# Altium project APP_1_huom2704.PrjPcb (part 3 of 3)

## Sheet APP_1_JTAG_m.SchDoc
size Tabloid; SheetNumber: 14; SheetTotal: 14; Sheet_Name: JTAG; Size: 11x17
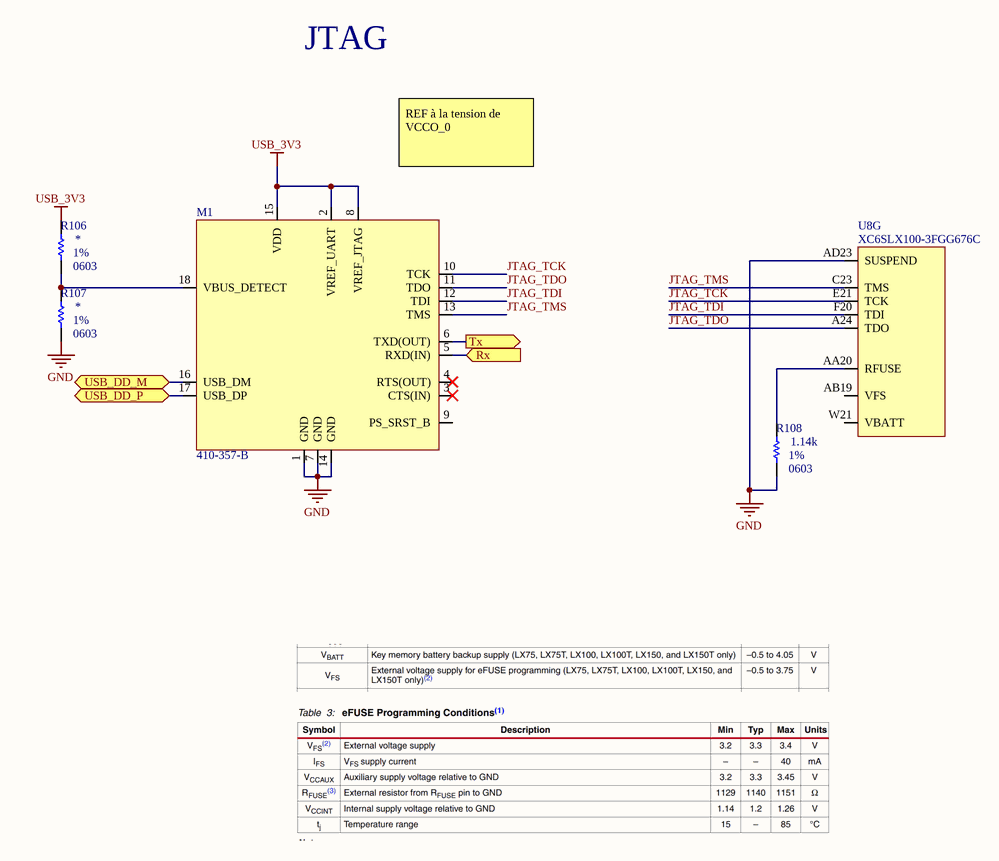
[diagram p12: APP_1_JTAG_m.SchDoc]

### Parts
M1  410-357-B  [MOD_JTAG_410-357-B]
R106  Package: 0603  Precision: 1%  [RES_0603]  (hidden comment: RES - 0603)
R107  Package: 0603  Precision: 1%  [RES_0603]  (hidden comment: RES - 0603)
R108  value 1.14k  Package: 0603  Precision: 1%  [RES_0603]  (hidden comment: RES - 0603)
U8  XC6SLX100-3FGG676C  [FPGA_XILINX_FGG676]  (part G of 10)

### Ports
Rx (in), Tx (out), USB_DD_M (bidir, see APP_1_Connectors_m[3B]), USB_DD_P (bidir, see APP_1_Connectors_m[3B])

### Nets
GND: M1.1(GND) M1.7(GND) M1.14(GND) R107.1 R108.1 U8.AD23(SUSPEND)
USB_3V3: M1.2(VREF_UART) M1.8(VREF_JTAG) M1.15(VDD) R106.2
JTAG_TCK: M1.10(TCK) U8.E21(TCK)
JTAG_TDI: M1.12(TDI) U8.F20(TDI)
JTAG_TDO: M1.11(TDO) U8.A24(TDO)
JTAG_TMS: M1.13(TMS) U8.C23(TMS)
Rx: M1.5(RXD(IN)) ; port Rx
Tx: M1.6(TXD(OUT)) ; port Tx
USB_DD_M: M1.16(USB_DM) ; port USB_DD_M
USB_DD_P: M1.17(USB_DP) ; port USB_DD_P
NetM1_18: M1.18(VBUS_DETECT) R106.1 R107.2
NetR108_2: R108.2 U8.AA20(RFUSE)

Not connected (* = marked no-connect by the designer): M1 3(CTS(IN))* 4(RTS(OUT))* 9(PS_SRST_B); U8 AB19(VFS) W21(VBATT)

### Notes on the sheet
- JTAG
- REF à la tension de VCCO_0
- Sheet Name
- Project Title
- Global Project
- Size
- Group
- Revision
- Date
- Sheet
- of
- Filename
- Designers

### Library data of the parts
M1 = MOD_JTAG_410-357-B: MOD - JTAG-SMT3-NC Programming Module For Xilinx FPGA - 18-SMT; Manufacturer #1: Digilent; Voltage Rating: VDD: 2.97V~3.63V, VJTAG/VUART: 1.65V~5.5V; GRAMS Lib Spec: 2.8; Note: Prior to reflow, the JTAG-SMT3-NC module must be dried at 125°C for 17 hours; Magnetic Material: Unknown; Polarized: Yes; Value: *; Tolerance: *; Current Rating: *; Power Max: *; HelpURL: https://reference.digilentinc.com/_media/reference/programmers/jtag-smt3/jtag-smt3-nc_rm.pdf; CreatedBy/Date: Tommy Rossignol 2018-11-23; VerifiedBy: Nicolas V. (2019-01-28); Temperature: -40°C ~ 85°C; Package: 18-pad SMT; Manufacturer #2: *; Assembly Type: SMD; Part Number #2: *; Part Number #1: 410-357-B; Supplier 1: Digi-Key; Supplier Part Number 1: 1286-1196-ND; Cryo: UNKNOWN
U8 = FPGA_XC6SLX100-3FGG676C: FPGA - XILINX SPARTAN 6 480 I/O - BGA-676; Voltage: 1.14 V ~ 1.26 V; Current: *; Power: *; Mfg: Xilinx; Mfg Part Number: XC6SLX100-3FGG676C; HelpURL: https://www.xilinx.com/support/documentation/data_sheets/ds162.pdf; CreatedBy: Jonathan Bouchard; Temperature: 0°C ~ 85°C (TJ); Value: *; Precision: *; Package: BGA-676; Supplier 1: Digikey; Supplier Part Number 1: 122-1760-ND
R106-R108 = RES - 0603: Current: *; CreatedBy: Jonathan Bouchard
  R106 R107: Value: *

## Sheet APP_1_PowerAnalog.SchDoc
size Tabloid; SheetNumber: 15; SheetTotal: 16; Sheet_Name: Power; Size: 11x17
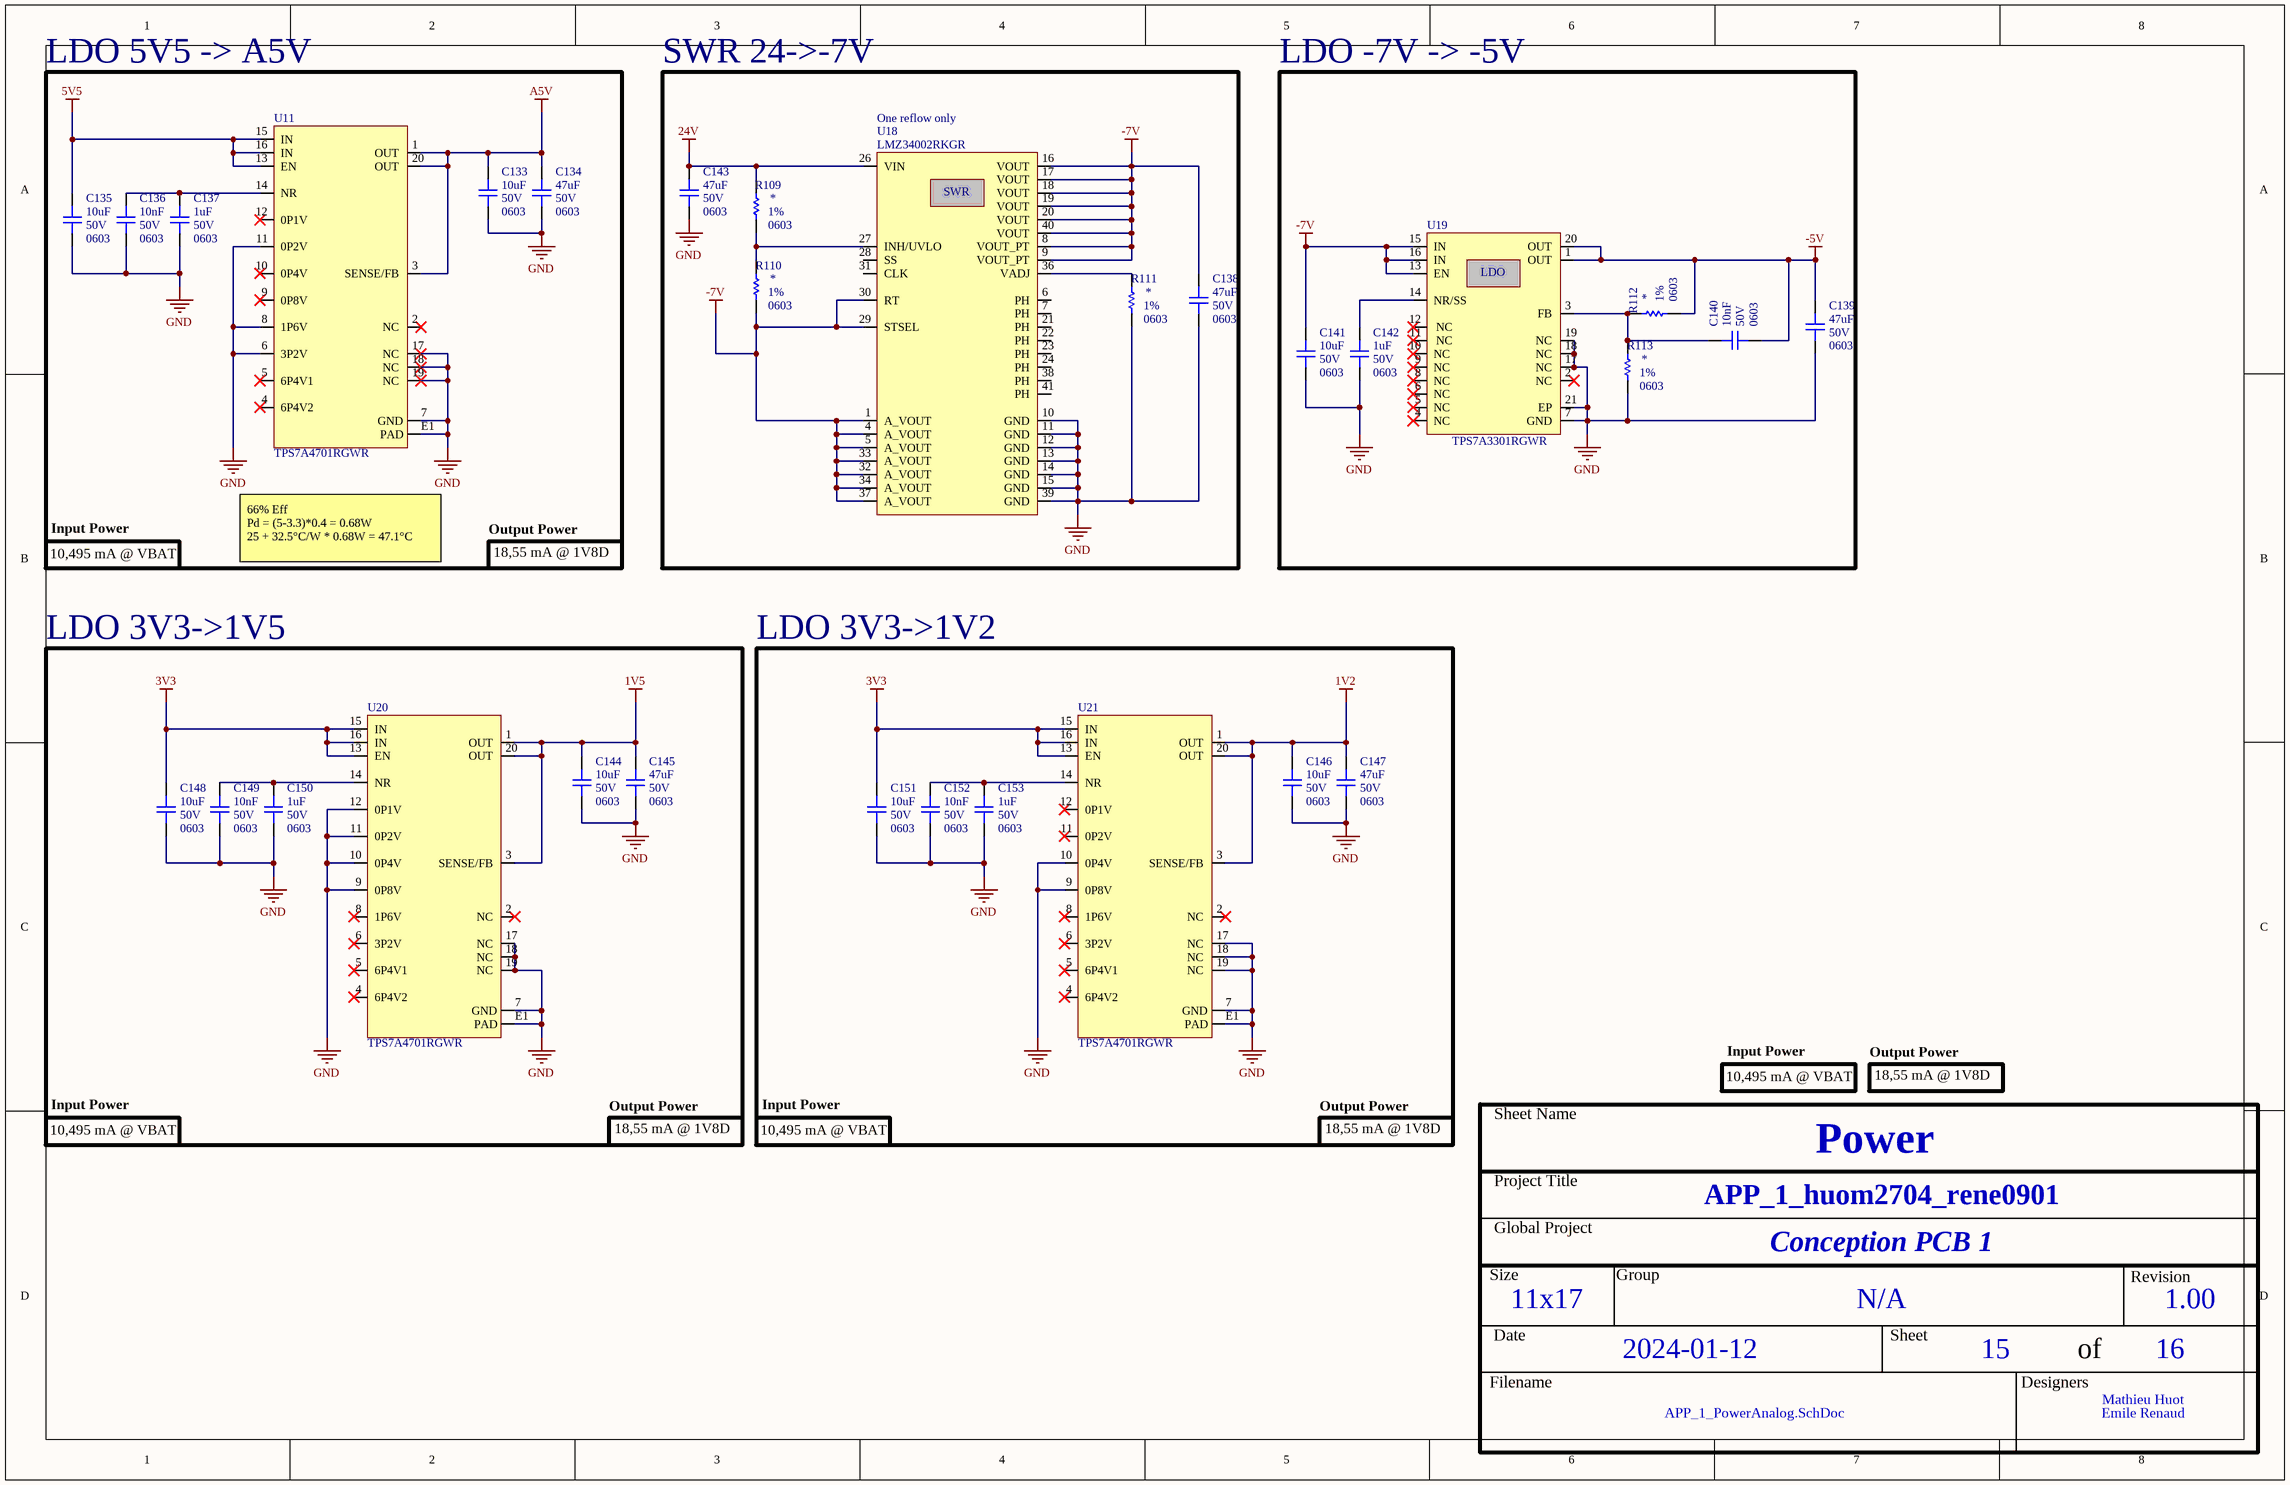
[diagram p13: APP_1_PowerAnalog.SchDoc]

### Parts
C133  value 10uF  Voltage: 50V  Package: 0603  [CAP_0603]  (hidden comment: CAP - 0603)
C134  value 47uF  Voltage: 50V  Package: 0603  [CAP_0603]  (hidden comment: CAP - 0603)
C135  value 10uF  Voltage: 50V  Package: 0603  [CAP_0603]  (hidden comment: CAP - 0603)
C136  value 10nF  Voltage: 50V  Package: 0603  [CAP_0603]  (hidden comment: CAP - 0603)
C137  value 1uF  Voltage: 50V  Package: 0603  [CAP_0603]  (hidden comment: CAP - 0603)
C138  value 47uF  Voltage: 50V  Package: 0603  [CAP_0603]  (hidden comment: CAP - 0603)
C139  value 47uF  Voltage: 50V  Package: 0603  [CAP_0603]  (hidden comment: CAP - 0603)
C140  value 10nF  Voltage: 50V  Package: 0603  [CAP_0603]  (hidden comment: CAP - 0603)
C141  value 10uF  Voltage: 50V  Package: 0603  [CAP_0603]  (hidden comment: CAP - 0603)
C142  value 1uF  Voltage: 50V  Package: 0603  [CAP_0603]  (hidden comment: CAP - 0603)
C143  value 47uF  Voltage: 50V  Package: 0603  [CAP_0603]  (hidden comment: CAP - 0603)
C144  value 10uF  Voltage: 50V  Package: 0603  [CAP_0603]  (hidden comment: CAP - 0603)
C145  value 47uF  Voltage: 50V  Package: 0603  [CAP_0603]  (hidden comment: CAP - 0603)
C146  value 10uF  Voltage: 50V  Package: 0603  [CAP_0603]  (hidden comment: CAP - 0603)
C147  value 47uF  Voltage: 50V  Package: 0603  [CAP_0603]  (hidden comment: CAP - 0603)
C148  value 10uF  Voltage: 50V  Package: 0603  [CAP_0603]  (hidden comment: CAP - 0603)
C149  value 10nF  Voltage: 50V  Package: 0603  [CAP_0603]  (hidden comment: CAP - 0603)
C150  value 1uF  Voltage: 50V  Package: 0603  [CAP_0603]  (hidden comment: CAP - 0603)
C151  value 10uF  Voltage: 50V  Package: 0603  [CAP_0603]  (hidden comment: CAP - 0603)
C152  value 10nF  Voltage: 50V  Package: 0603  [CAP_0603]  (hidden comment: CAP - 0603)
C153  value 1uF  Voltage: 50V  Package: 0603  [CAP_0603]  (hidden comment: CAP - 0603)
R109  Package: 0603  Precision: 1%  [RES_0603]  (hidden comment: RES - 0603)
R110  Package: 0603  Precision: 1%  [RES_0603]  (hidden comment: RES - 0603)
R111  Package: 0603  Precision: 1%  [RES_0603]  (hidden comment: RES - 0603)
R112  Package: 0603  Precision: 1%  [RES_0603]  (hidden comment: RES - 0603)
R113  Package: 0603  Precision: 1%  [RES_0603]  (hidden comment: RES - 0603)
U11  TPS7A4701RGWR  [REG_TPS7A4701RGWR]
U18  LMZ34002RKGR  Assembly Note: One reflow only  [REG_SWR_LMZ34002RKGR]
U19  TPS7A3301RGWR  [REG_LDO_TPS7A3301RGWR]
U20  TPS7A4701RGWR  [REG_TPS7A4701RGWR]
U21  TPS7A4701RGWR  [REG_TPS7A4701RGWR]

### Blocks framed on the sheet
LDO 5V5 -> A5V: C133-C137 U11
SWR 24->-7V: C138 C143 R109-R111 U18
LDO -7V -> -5V: C139-C142 R112 R113 U19
LDO 3V3->1V5: C144 C145 C148-C150 U20
LDO 3V3->1V2: C146 C147 C151-C153 U21

### Nets
1V2: C146.2 C147.2 U21.1(OUT) U21.3(SENSE/FB) U21.20(OUT)
1V5: C144.2 C145.2 U20.1(OUT) U20.3(SENSE/FB) U20.20(OUT)
3V3: C148.2 C151.2 U20.13(EN) U20.15(IN) U20.16(IN) U21.13(EN) U21.15(IN) U21.16(IN)
5V5: C135.2 U11.13(EN) U11.15(IN) U11.16(IN)
24V: C143.2 R109.2 U18.26(VIN)
-5V: C139.2 C140.1 R112.1 U19.1(OUT) U19.20(OUT)
-7V: C138.2 C141.2 R110.1 U18.1(A_VOUT) U18.4(A_VOUT) U18.5(A_VOUT) U18.8(VOUT_PT) U18.9(VOUT_PT) U18.16(VOUT) U18.17(VOUT) U18.18(VOUT) U18.19(VOUT) U18.20(VOUT) U18.29(STSEL) U18.30(RT) U18.32(A_VOUT) U18.33(A_VOUT) U18.34(A_VOUT) U18.37(A_VOUT) U18.40(VOUT) U19.13(EN) U19.15(IN) U19.16(IN)
A5V: C133.2 C134.2 U11.1(OUT) U11.3(SENSE/FB) U11.20(OUT)
GND: C133.1 C134.1 C135.1 C136.1 C137.1 C138.1 C139.1 C141.1 C142.1 C143.1 C144.1 C145.1 C146.1 C147.1 C148.1 C149.1 C150.1 C151.1 C152.1 C153.1 R111.1 R113.1 U11.6(3P2V) U11.7(GND) U11.8(1P6V) U11.11(0P2V) U11.17(NC) U11.18(NC) U11.19(NC) U11.E1(PAD) U18.10(GND) U18.11(GND) U18.12(GND) U18.13(GND) U18.14(GND) U18.15(GND) U18.39(GND) U19.7(GND) U19.17(NC) U19.18(NC) U19.19(NC) U19.21(EP) U20.7(GND) U20.9(0P8V) U20.10(0P4V) U20.11(0P2V) U20.12(0P1V) U20.17(NC) U20.18(NC) U20.19(NC) U20.E1(PAD) U21.7(GND) U21.9(0P8V) U21.10(0P4V) U21.17(NC) U21.18(NC) U21.19(NC) U21.E1(PAD)
NetC136_2: C136.2 C137.2 U11.14(NR)
NetC140_2: C140.2 R112.2 R113.2 U19.3(FB)
NetC142_2: C142.2 U19.14(NR/SS)
NetC149_2: C149.2 C150.2 U20.14(NR)
NetC152_2: C152.2 C153.2 U21.14(NR)
NetR109_1: R109.1 R110.2 U18.27(INH/UVLO)
NetR111_2: R111.2 U18.36(VADJ)

Not connected (* = marked no-connect by the designer): U11 2(NC)* 4(6P4V2)* 5(6P4V1)* 9(0P8V)* 10(0P4V)* 12(0P1V)*; U18 2(DNC) 3(DNC) 6(PH) 7(PH) 21(PH) 22(PH) 23(PH) 24(PH) 25(DNC) 28(SS) 31(CLK) 35(DNC) 38(PH) 41(PH); U19 2(NC)* 4(NC)* 5(NC)* 6(NC)* 8(NC)* 9(NC)* 10(NC)* 11(NC)* 12(NC)*; U20 2(NC)* 4(6P4V2)* 5(6P4V1)* 6(3P2V)* 8(1P6V)*; U21 2(NC)* 4(6P4V2)* 5(6P4V1)* 6(3P2V)* 8(1P6V)* 11(0P2V)* 12(0P1V)*

### Notes on the sheet
- 10,495 mA @ VBAT
- Input Power
- 66% Eff
  Pd = (5-3.3)*0.4 = 0.68W
  25 + 32.5°C/W * 0.68W = 47.1°C
- Output Power
- 18,55 mA @ 1V8D
- Sheet Name
- Project Title
- Global Project
- Size
- Group
- Revision
- Date
- Sheet
- of
- Filename
- Designers
- (in symbol REG_LDO_TPS7A3301RGWR) LDO
- (in symbol REG_SWR_LMZ34002RKGR) SWR

### Library data of the parts
C133-C153 = CAP - 0603: Precision: 10%; Current: *; CreatedBy: Jonathan Bouchard; Power: *
U11 U20 U21 = REG_LDO_TPS7A4701RGWR: REG - LINEAR POS ADJ 1A - 20VQFN; Manufacturer #1: Texas Instruments; GRAMS Lib Spec: 2.8; Magnetic Material: Unknown; Polarized: Yes; Value: 1.4 à 34V; Voltage rating: 35V max; Assembly Type: SMD; CreatedBy/Date: L-P Gauthier / 2018-05-29; Current Rating: 1A; Manufacturer #2: TBD; Part Number #1: TPS7A4701RGWR; Part Number #2: TBD; Package: 20-VQFN Exposed Pad; Power Max: *; Tolerance: -; Supplier 1: Digi-Key; Supplier Part Number 1: 296-37224-1-ND; VerifiedBy: Caroline Paulin - 28 sept 2018; Temperature: -40°C ~ 125°C; HelpURL: http://www.ti.com/lit/ds/symlink/tps7a47.pdf; Cryo: UNKNOWN
U18 = REG_SWR_LMZ34002RKGR: REG - DC DC Converter -3V to -17V 2A - 41-B1QFN; Manufacturer #1: Texas Instruments; Value: -3 ~ -17V; Voltage Rating: 4.5-40V; Power Max: 15W; GRAMS Lib Spec: 2.8c; Magnetic Material: Unknown; Polarized: Yes; Tolerance: *; Current Rating: 2A; HelpURL: http://www.ti.com/lit/ds/symlink/lmz34002.pdf; CreatedBy/Date: P.Marcoux  20-06-2019; VerifiedBy: C.Paulin - 22/01/2020; Temperature: -40°C ~ 85°C; Package: 41-B1QFN; Manufacturer #2: *; Note: *; Assembly Type: SMD; Part Number #2: *; Part Number #1: LMZ34002RKGR; Supplier 1: Digi-Key; Supplier Part Number 1: 296-44356-1-ND; Cryo: UNKNOWN
U19 = REG_LDO_TPS7A3301RGWR: REG - LDO Negative Adjustable 1 Output -1.18V-33V 1A -  20-VQFN (5x5); Manufacturer #1: Texas Instruments; Value: -1.18V~-33V; Voltage Rating: -36V; GRAMS Lib Spec: 2.8; Magnetic Material: Unknown; Polarized: Yes; Tolerance: *; Current Rating: 1A; Power Max: *; HelpURL: http://www.ti.com/lit/ds/symlink/tps7a33.pdf; CreatedBy/Date: Keven Deslandes - 2018/10/11; VerifiedBy: Caroline Paulin - 11/12/2018; Temperature: -40°C ~ 125°C; Package: 20-VQFN; Manufacturer #2: *; Assembly Type: SMD; Part Number #2: *; Part Number #1: TPS7A3301RGWR; Supplier 1: Digi-Key; Supplier Part Number 1: 296-39502-1-ND; Cryo: UNKNOWN
R109-R113 = RES - 0603: Current: *; CreatedBy: Jonathan Bouchard; Value: *

## Sheet APP_1_FPGA_2.SchDoc
size Tabloid; SheetNumber: 16; SheetTotal: 16; Sheet_Name: FPGA_2; Size: 11x17
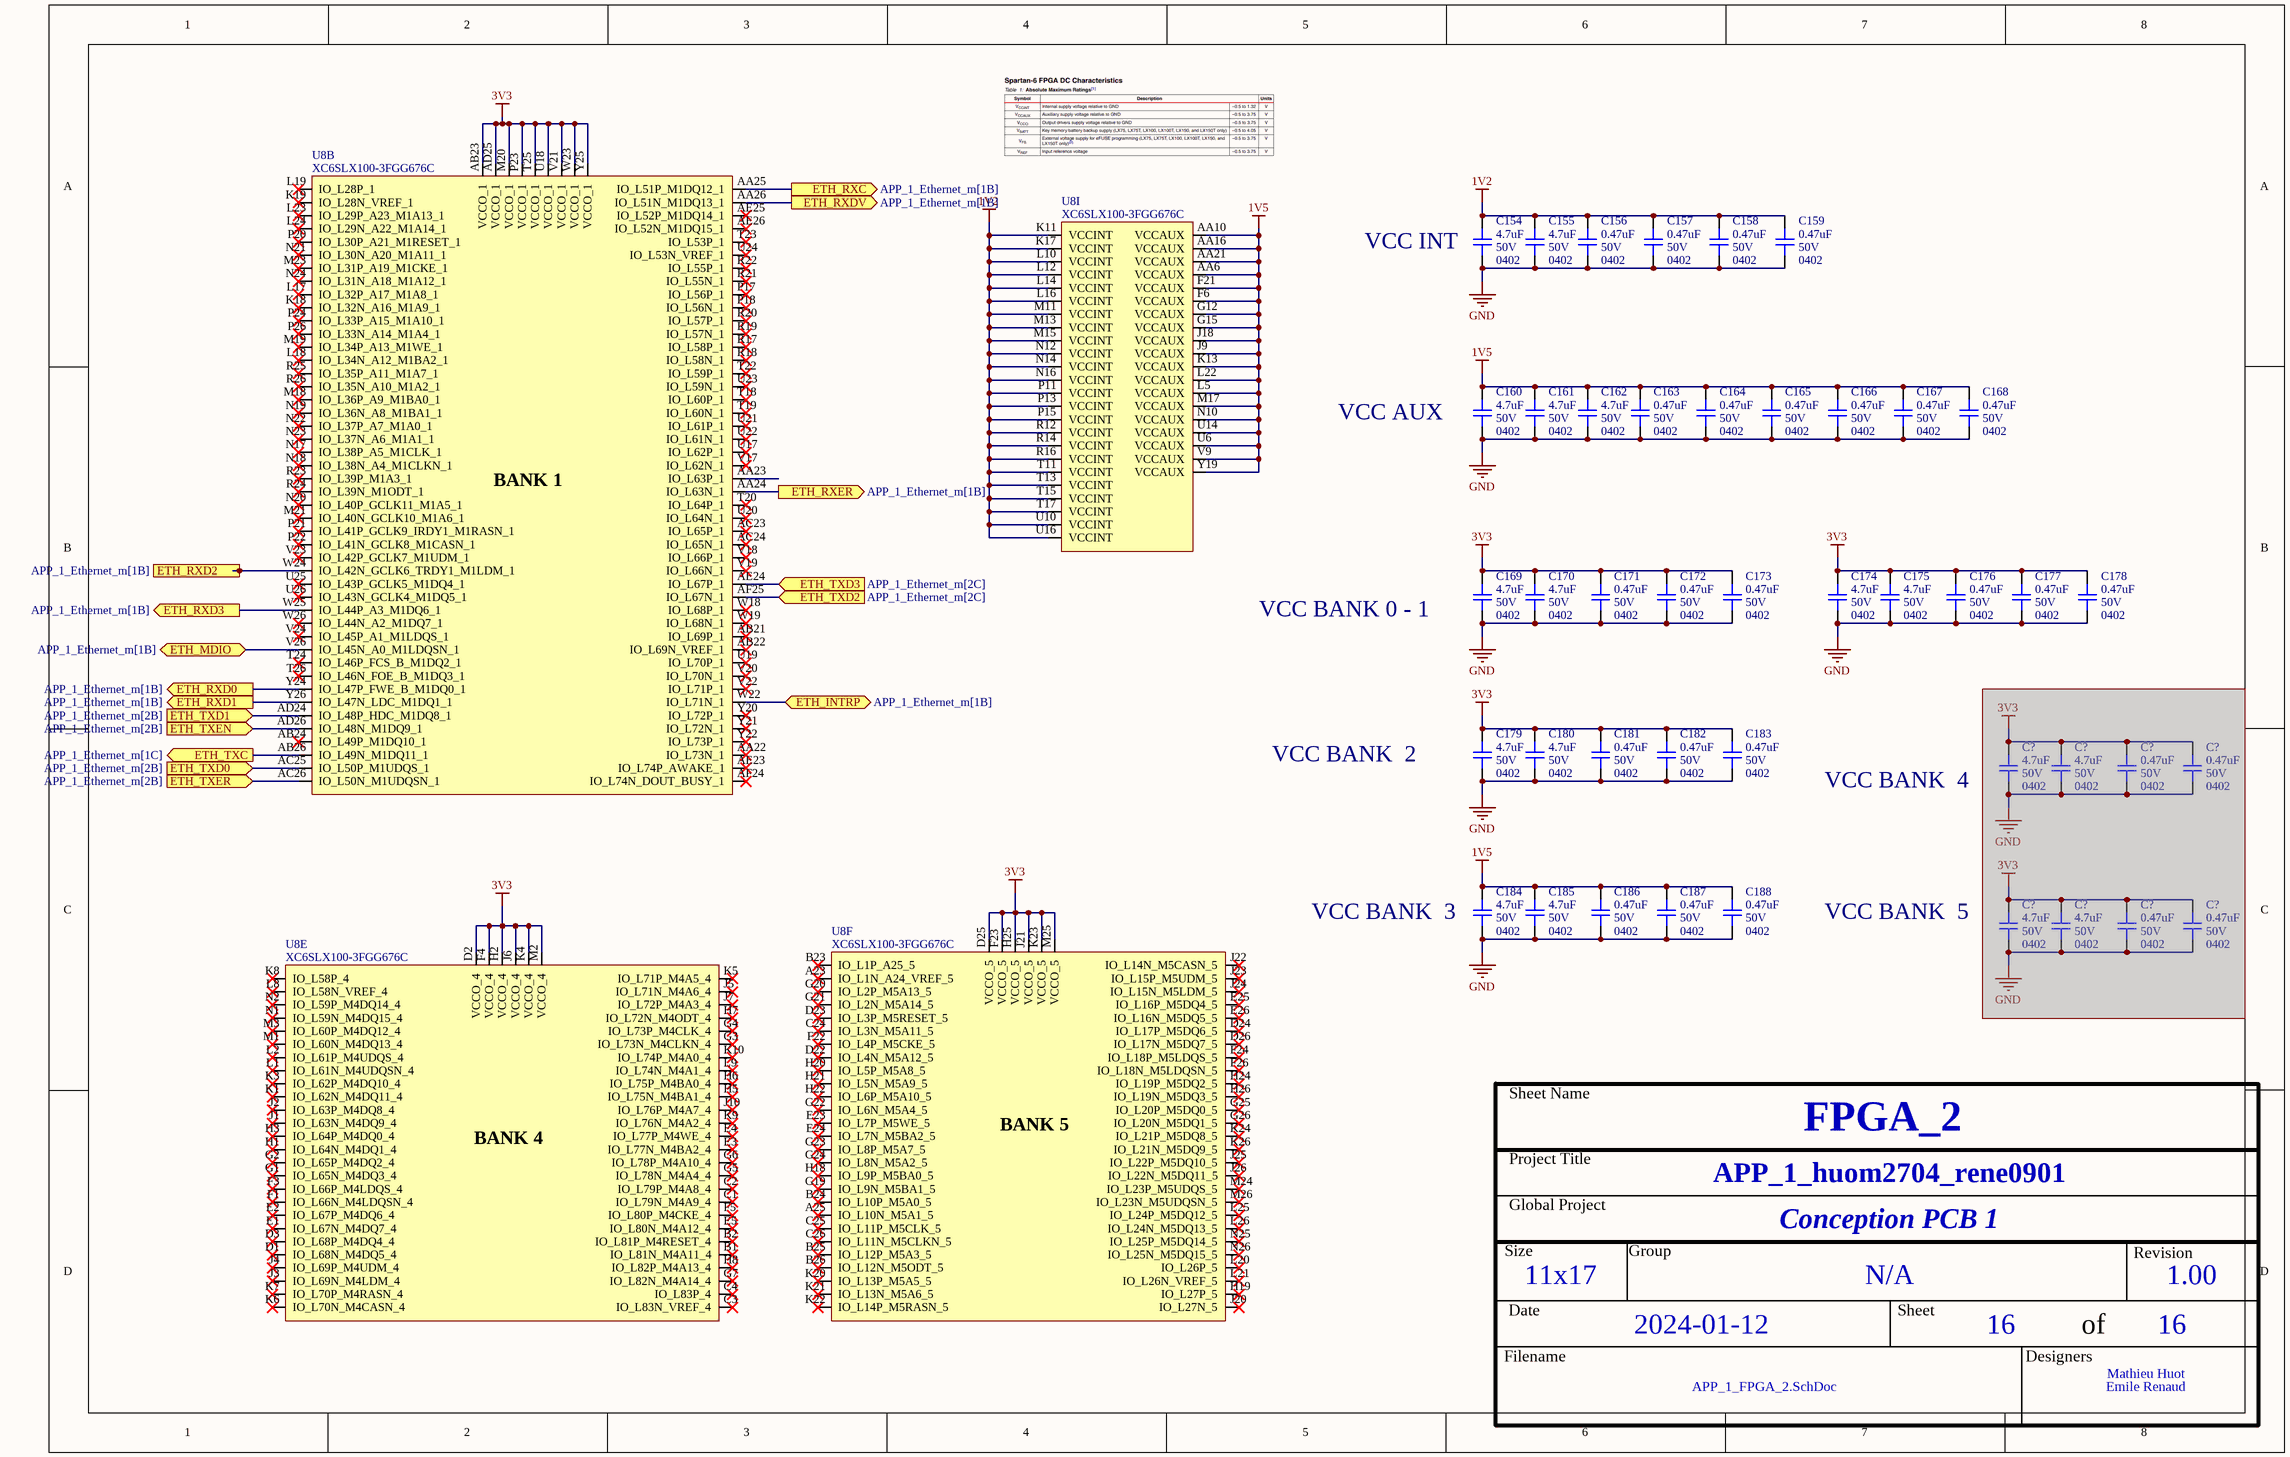
[diagram p14: APP_1_FPGA_2.SchDoc]

### Parts
(Parts that share a designator on the sheet are numbered #1, #2 ... from top to bottom, then left to right.)
C154  value 4.7uF  Voltage: 50V  Package: 0402  [CAP_0402]  (hidden comment: CAP - 0402)
C155  value 4.7uF  Voltage: 50V  Package: 0402  [CAP_0402]  (hidden comment: CAP - 0402)
C156  value 0.47uF  Voltage: 50V  Package: 0402  [CAP_0402]  (hidden comment: CAP - 0402)
C157  value 0.47uF  Voltage: 50V  Package: 0402  [CAP_0402]  (hidden comment: CAP - 0402)
C158  value 0.47uF  Voltage: 50V  Package: 0402  [CAP_0402]  (hidden comment: CAP - 0402)
C159  value 0.47uF  Voltage: 50V  Package: 0402  [CAP_0402]  (hidden comment: CAP - 0402)
C160  value 4.7uF  Voltage: 50V  Package: 0402  [CAP_0402]  (hidden comment: CAP - 0402)
C161  value 4.7uF  Voltage: 50V  Package: 0402  [CAP_0402]  (hidden comment: CAP - 0402)
C162  value 4.7uF  Voltage: 50V  Package: 0402  [CAP_0402]  (hidden comment: CAP - 0402)
C163  value 0.47uF  Voltage: 50V  Package: 0402  [CAP_0402]  (hidden comment: CAP - 0402)
C164  value 0.47uF  Voltage: 50V  Package: 0402  [CAP_0402]  (hidden comment: CAP - 0402)
C165  value 0.47uF  Voltage: 50V  Package: 0402  [CAP_0402]  (hidden comment: CAP - 0402)
C166  value 0.47uF  Voltage: 50V  Package: 0402  [CAP_0402]  (hidden comment: CAP - 0402)
C167  value 0.47uF  Voltage: 50V  Package: 0402  [CAP_0402]  (hidden comment: CAP - 0402)
C168  value 0.47uF  Voltage: 50V  Package: 0402  [CAP_0402]  (hidden comment: CAP - 0402)
C169  value 4.7uF  Voltage: 50V  Package: 0402  [CAP_0402]  (hidden comment: CAP - 0402)
C170  value 4.7uF  Voltage: 50V  Package: 0402  [CAP_0402]  (hidden comment: CAP - 0402)
C171  value 0.47uF  Voltage: 50V  Package: 0402  [CAP_0402]  (hidden comment: CAP - 0402)
C172  value 0.47uF  Voltage: 50V  Package: 0402  [CAP_0402]  (hidden comment: CAP - 0402)
C173  value 0.47uF  Voltage: 50V  Package: 0402  [CAP_0402]  (hidden comment: CAP - 0402)
C174  value 4.7uF  Voltage: 50V  Package: 0402  [CAP_0402]  (hidden comment: CAP - 0402)
C175  value 4.7uF  Voltage: 50V  Package: 0402  [CAP_0402]  (hidden comment: CAP - 0402)
C176  value 0.47uF  Voltage: 50V  Package: 0402  [CAP_0402]  (hidden comment: CAP - 0402)
C177  value 0.47uF  Voltage: 50V  Package: 0402  [CAP_0402]  (hidden comment: CAP - 0402)
C178  value 0.47uF  Voltage: 50V  Package: 0402  [CAP_0402]  (hidden comment: CAP - 0402)
C179  value 4.7uF  Voltage: 50V  Package: 0402  [CAP_0402]  (hidden comment: CAP - 0402)
C180  value 4.7uF  Voltage: 50V  Package: 0402  [CAP_0402]  (hidden comment: CAP - 0402)
C181  value 0.47uF  Voltage: 50V  Package: 0402  [CAP_0402]  (hidden comment: CAP - 0402)
C182  value 0.47uF  Voltage: 50V  Package: 0402  [CAP_0402]  (hidden comment: CAP - 0402)
C183  value 0.47uF  Voltage: 50V  Package: 0402  [CAP_0402]  (hidden comment: CAP - 0402)
C184  value 4.7uF  Voltage: 50V  Package: 0402  [CAP_0402]  (hidden comment: CAP - 0402)
C185  value 4.7uF  Voltage: 50V  Package: 0402  [CAP_0402]  (hidden comment: CAP - 0402)
C186  value 0.47uF  Voltage: 50V  Package: 0402  [CAP_0402]  (hidden comment: CAP - 0402)
C187  value 0.47uF  Voltage: 50V  Package: 0402  [CAP_0402]  (hidden comment: CAP - 0402)
C188  value 0.47uF  Voltage: 50V  Package: 0402  [CAP_0402]  (hidden comment: CAP - 0402)
C?#1  value 4.7uF  Voltage: 50V  Package: 0402  [CAP_0402]  (hidden comment: CAP - 0402)  (masked out: inside a compile mask, not in the netlist)
C?#2  value 4.7uF  Voltage: 50V  Package: 0402  [CAP_0402]  (hidden comment: CAP - 0402)  (masked out: inside a compile mask, not in the netlist)
C?#3  value 0.47uF  Voltage: 50V  Package: 0402  [CAP_0402]  (hidden comment: CAP - 0402)  (masked out: inside a compile mask, not in the netlist)
C?#4  value 0.47uF  Voltage: 50V  Package: 0402  [CAP_0402]  (hidden comment: CAP - 0402)  (masked out: inside a compile mask, not in the netlist)
C?#5  value 4.7uF  Voltage: 50V  Package: 0402  [CAP_0402]  (hidden comment: CAP - 0402)  (masked out: inside a compile mask, not in the netlist)
C?#6  value 4.7uF  Voltage: 50V  Package: 0402  [CAP_0402]  (hidden comment: CAP - 0402)  (masked out: inside a compile mask, not in the netlist)
C?#7  value 0.47uF  Voltage: 50V  Package: 0402  [CAP_0402]  (hidden comment: CAP - 0402)  (masked out: inside a compile mask, not in the netlist)
C?#8  value 0.47uF  Voltage: 50V  Package: 0402  [CAP_0402]  (hidden comment: CAP - 0402)  (masked out: inside a compile mask, not in the netlist)
U8  XC6SLX100-3FGG676C  [FPGA_XILINX_FGG676]  (parts B,E,F,I of 10)

### Ports
ETH_INTRP (bidir, see APP_1_Ethernet_m[1B]), ETH_MDIO (bidir, see APP_1_Ethernet_m[1B]), ETH_RXC (out, see APP_1_Ethernet_m[1B]), ETH_RXD0 (out, see APP_1_Ethernet_m[1B]), ETH_RXD1 (out, see APP_1_Ethernet_m[1B]), ETH_RXD2 (out, see APP_1_Ethernet_m[1B]), ETH_RXD3 (out, see APP_1_Ethernet_m[1B]), ETH_RXDV (out, see APP_1_Ethernet_m[1B]), ETH_RXER (out, see APP_1_Ethernet_m[1B]), ETH_TXC (out, see APP_1_Ethernet_m[1C]), ETH_TXD0 (in, see APP_1_Ethernet_m[2B]), ETH_TXD1 (in, see APP_1_Ethernet_m[2B]), ETH_TXD2 (in, see APP_1_Ethernet_m[2C]), ETH_TXD3 (in, see APP_1_Ethernet_m[2C]), ETH_TXEN (in, see APP_1_Ethernet_m[2B]), ETH_TXER (in, see APP_1_Ethernet_m[2B])

### Nets
1V2: C154.2 C155.2 C156.2 C157.2 C158.2 C159.2 U8.K11(VCCINT) U8.K17(VCCINT) U8.L10(VCCINT) U8.L12(VCCINT) U8.L14(VCCINT) U8.L16(VCCINT) U8.M11(VCCINT) U8.M13(VCCINT) U8.M15(VCCINT) U8.N12(VCCINT) U8.N14(VCCINT) U8.N16(VCCINT) U8.P11(VCCINT) U8.P13(VCCINT) U8.P15(VCCINT) U8.R12(VCCINT) U8.R14(VCCINT) U8.R16(VCCINT) U8.T11(VCCINT) U8.T13(VCCINT) U8.T15(VCCINT) U8.T17(VCCINT) U8.U10(VCCINT) U8.U16(VCCINT)
1V5: C160.2 C161.2 C162.2 C163.2 C164.2 C165.2 C166.2 C167.2 C168.2 C184.2 C185.2 C186.2 C187.2 C188.2 U8.AA6(VCCAUX) U8.AA10(VCCAUX) U8.AA16(VCCAUX) U8.AA21(VCCAUX) U8.F6(VCCAUX) U8.F21(VCCAUX) U8.G12(VCCAUX) U8.G15(VCCAUX) U8.J9(VCCAUX) U8.J18(VCCAUX) U8.K13(VCCAUX) U8.L5(VCCAUX) U8.L22(VCCAUX) U8.M17(VCCAUX) U8.N10(VCCAUX) U8.U6(VCCAUX) U8.U14(VCCAUX) U8.V9(VCCAUX) U8.Y19(VCCAUX)
3V3: C169.2 C170.2 C171.2 C172.2 C173.2 C174.2 C175.2 C176.2 C177.2 C178.2 C179.2 C180.2 C181.2 C182.2 C183.2 U8.AB23(VCCO_1) U8.AD25(VCCO_1) U8.D2(VCCO_4) U8.D25(VCCO_5) U8.F4(VCCO_4) U8.F23(VCCO_5) U8.H2(VCCO_4) U8.H25(VCCO_5) U8.J6(VCCO_4) U8.J21(VCCO_5) U8.K4(VCCO_4) U8.K23(VCCO_5) U8.M2(VCCO_4) U8.M20(VCCO_1) U8.M25(VCCO_5) U8.P23(VCCO_1) U8.T25(VCCO_1) U8.U18(VCCO_1) U8.V21(VCCO_1) U8.W23(VCCO_1) U8.Y25(VCCO_1)
GND: C154.1 C155.1 C156.1 C157.1 C158.1 C159.1 C160.1 C161.1 C162.1 C163.1 C164.1 C165.1 C166.1 C167.1 C168.1 C169.1 C170.1 C171.1 C172.1 C173.1 C174.1 C175.1 C176.1 C177.1 C178.1 C179.1 C180.1 C181.1 C182.1 C183.1 C184.1 C185.1 C186.1 C187.1 C188.1
ETH_INTRP: U8.W22(IO_L71N_1) ; port ETH_INTRP
ETH_MDIO: U8.V26(IO_L45N_A0_M1LDQSN_1) ; port ETH_MDIO
ETH_RXC: U8.AA25(IO_L51P_M1DQ12_1) ; port ETH_RXC
ETH_RXD0: U8.Y24(IO_L47P_FWE_B_M1DQ0_1) ; port ETH_RXD0
ETH_RXD1: U8.Y26(IO_L47N_LDC_M1DQ1_1) ; port ETH_RXD1
ETH_RXD2: U8.W24(IO_L42N_GCLK6_TRDY1_M1LDM_1) ; port ETH_RXD2
ETH_RXD3: U8.W25(IO_L44P_A3_M1DQ6_1) ; port ETH_RXD3
ETH_RXDV: U8.AA26(IO_L51N_M1DQ13_1) ; port ETH_RXDV
ETH_RXER: U8.AA24(IO_L63N_1) ; port ETH_RXER
ETH_TXC: U8.AB26(IO_L49N_M1DQ11_1) ; port ETH_TXC
ETH_TXD0: U8.AC25(IO_L50P_M1UDQS_1) ; port ETH_TXD0
ETH_TXD1: U8.AD24(IO_L48P_HDC_M1DQ8_1) ; port ETH_TXD1
ETH_TXD2: U8.AF25(IO_L67N_1) ; port ETH_TXD2
ETH_TXD3: U8.AE24(IO_L67P_1) ; port ETH_TXD3
ETH_TXEN: U8.AD26(IO_L48N_M1DQ9_1) ; port ETH_TXEN
ETH_TXER: U8.AC26(IO_L50N_M1UDQSN_1) ; port ETH_TXER

Not connected (* = marked no-connect by the designer): U8 A23(IO_L1N_A24_VREF_5)* A25(IO_L10N_M5A1_5)* AA22(IO_L73N_1)* AA23(IO_L63P_1) AB21(IO_L69P_1)* AB22(IO_L69N_VREF_1)* AB24(IO_L49P_M1DQ10_1)* AC23(IO_L65P_1)* AC24(IO_L65N_1)* AE23(IO_L74P_AWAKE_1)* AE25(IO_L52P_M1DQ14_1)* AE26(IO_L52N_M1DQ15_1)* AF24(IO_L74N_DOUT_BUSY_1)* B1(IO_L81N_M4A11_4)* B2(IO_L81P_M4RESET_4)* B23(IO_L1P_A25_5)* B24(IO_L10P_M5A0_5)* B25(IO_L12P_M5A3_5)* B26(IO_L12N_M5ODT_5)* C1(IO_L79N_M4A9_4)* C2(IO_L79P_M4A8_4)* C3(IO_L83N_VREF_4)* C4(IO_L83P_4)* C24(IO_L3N_M5A11_5)* C25(IO_L11P_M5CLK_5)* C26(IO_L11N_M5CLKN_5)* D1(IO_L68N_M4DQ5_4)* D3(IO_L68P_M4DQ4_4)* D22(IO_L4N_M5A12_5)* D23(IO_L3P_M5RESET_5)* D24(IO_L17P_M5DQ6_5)* D26(IO_L17N_M5DQ7_5)* E1(IO_L67N_M4DQ7_4)* E2(IO_L67P_M4DQ6_4)* E3(IO_L77N_M4BA2_4)* E4(IO_L77P_M4WE_4)* E5(IO_L80N_M4A12_4)* E23(IO_L7P_M5WE_5)* E24(IO_L7N_M5BA2_5)* E25(IO_L16P_M5DQ4_5)* E26(IO_L16N_M5DQ5_5)* F1(IO_L66N_M4LDQSN_4)* F3(IO_L66P_M4LDQS_4)* F5(IO_L80P_M4CKE_4)* F22(IO_L4P_M5CKE_5)* F24(IO_L18P_M5LDQS_5)* F26(IO_L18N_M5LDQSN_5)* G1(IO_L65N_M4DQ3_4)* G2(IO_L65P_M4DQ2_4)* G3(IO_L73N_M4CLKN_4)* G4(IO_L73P_M4CLK_4)* G5(IO_L78N_M4A4_4)* G6(IO_L78P_M4A10_4)* G7(IO_L82N_M4A14_4)* G19(IO_L9N_M5BA1_5)* G20(IO_L2P_M5A13_5)* G21(IO_L2N_M5A14_5)* G22(IO_L6N_M5A4_5)* G23(IO_L8P_M5A7_5)* G24(IO_L8N_M5A2_5)* G25(IO_L20P_M5DQ0_5)* G26(IO_L20N_M5DQ1_5)* H1(IO_L64N_M4DQ1_4)* H3(IO_L64P_M4DQ0_4)* H5(IO_L75N_M4BA1_4)* H6(IO_L75P_M4BA0_4)* H7(IO_L72N_M4ODT_4)* H8(IO_L82P_M4A13_4)* H18(IO_L9P_M5BA0_5)* H19(IO_L27P_5)* H20(IO_L5P_M5A8_5)* H21(IO_L5N_M5A9_5)* H22(IO_L6P_M5A10_5)* H24(IO_L19P_M5DQ2_5)* H26(IO_L19N_M5DQ3_5)* J1(IO_L63N_M4DQ9_4)* J2(IO_L63P_M4DQ8_4)* J3(IO_L69N_M4LDM_4)* J4(IO_L69P_M4UDM_4)* J5(IO_L71N_M4A6_4)* J7(IO_L72P_M4A3_4)* J10(IO_L76P_M4A7_4)* J20(IO_L27N_5)* J22(IO_L14N_M5CASN_5)* J23(IO_L15P_M5UDM_5)* J24(IO_L15N_M5LDM_5)* J25(IO_L22P_M5DQ10_5)* J26(IO_L22N_M5DQ11_5)* K1(IO_L62N_M4DQ11_4)* K3(IO_L62P_M4DQ10_4)* K5(IO_L71P_M4A5_4)* K6(IO_L70N_M4CASN_4)* K7(IO_L70P_M4RASN_4)* K8(IO_L58P_4)* K9(IO_L76N_M4A2_4)* K10(IO_L74P_M4A0_4)* K18(IO_L32N_A16_M1A9_1)* K19(IO_L28N_VREF_1)* K20(IO_L13P_M5A5_5)* K21(IO_L13N_M5A6_5)* K22(IO_L14P_M5RASN_5)* K24(IO_L21P_M5DQ8_5)* K26(IO_L21N_M5DQ9_5)* L1(IO_L61N_M4UDQSN_4)* L2(IO_L61P_M4UDQS_4)* L8(IO_L58N_VREF_4)* L9(IO_L74N_M4A1_4)* L17(IO_L32P_A17_M1A8_1)* L18(IO_L34N_A12_M1BA2_1)* L19(IO_L28P_1)* L20(IO_L26P_5)* L21(IO_L26N_VREF_5)* L23(IO_L29P_A23_M1A13_1)* L24(IO_L29N_A22_M1A14_1)* L25(IO_L24P_M5DQ12_5)* L26(IO_L24N_M5DQ13_5)* M1(IO_L60N_M4DQ13_4)* M3(IO_L60P_M4DQ12_4)* M18(IO_L36P_A9_M1BA0_1)* M19(IO_L34P_A13_M1WE_1)* M21(IO_L40N_GCLK10_M1A6_1)* M23(IO_L31P_A19_M1CKE_1)* M24(IO_L23P_M5UDQS_5)* M26(IO_L23N_M5UDQSN_5)* N1(IO_L59N_M4DQ15_4)* N2(IO_L59P_M4DQ14_4)* N17(IO_L38P_A5_M1CLK_1)* N18(IO_L38N_A4_M1CLKN_1)* N19(IO_L36N_A8_M1BA1_1)* N20(IO_L40P_GCLK11_M1A5_1)* N21(IO_L30N_A20_M1A11_1)* N22(IO_L37P_A7_M1A0_1)* N23(IO_L37N_A6_M1A1_1)* N24(IO_L31N_A18_M1A12_1)* N25(IO_L25P_M5DQ14_5)* N26(IO_L25N_M5DQ15_5)* P17(IO_L56P_1)* P18(IO_L56N_1)* P20(IO_L30P_A21_M1RESET_1)* P21(IO_L41P_GCLK9_IRDY1_M1RASN_1)* P22(IO_L41N_GCLK8_M1CASN_1)* P24(IO_L33P_A15_M1A10_1)* P26(IO_L33N_A14_M1A4_1)* R17(IO_L58P_1)* R18(IO_L58N_1)* R19(IO_L57N_1)* R20(IO_L57P_1)* R21(IO_L55N_1)* R22(IO_L55P_1)* R23(IO_L39P_M1A3_1)* R24(IO_L39N_M1ODT_1)* R25(IO_L35P_A11_M1A7_1)* R26(IO_L35N_A10_M1A2_1)* T18(IO_L60P_1)* T19(IO_L60N_1)* T20(IO_L64P_1)* T22(IO_L59P_1)* T23(IO_L53P_1)* T24(IO_L46P_FCS_B_M1DQ2_1)* T26(IO_L46N_FOE_B_M1DQ3_1)* U17(IO_L62P_1)* U19(IO_L70P_1)* U20(IO_L64N_1)* U21(IO_L61P_1)* U22(IO_L61N_1)* U23(IO_L59N_1)* U24(IO_L53N_VREF_1)* U25(IO_L43P_GCLK5_M1DQ4_1)* U26(IO_L43N_GCLK4_M1DQ5_1)* V17(IO_L62N_1)* V18(IO_L66P_1)* V19(IO_L66N_1)* V20(IO_L70N_1)* V22(IO_L71P_1)* V23(IO_L42P_GCLK7_M1UDM_1)* V24(IO_L45P_A1_M1LDQS_1)* W18(IO_L68P_1)* W19(IO_L68N_1)* W26(IO_L44N_A2_M1DQ7_1)* Y20(IO_L72P_1)* Y21(IO_L72N_1)* Y22(IO_L73P_1)*

### Notes on the sheet
- (near C154) VCC INT
- VCC AUX
- VCC BANK 0 - 1
- VCC BANK  2
- VCC BANK  4
- (near C184) VCC BANK  3
- VCC BANK  5
- Sheet Name
- Project Title
- Global Project
- Size
- Group
- Revision
- Date
- Sheet
- of
- Filename
- Designers
- (in symbol FPGA_XC6SLX100-3FGG676C, part B) BANK 1
- (in symbol FPGA_XC6SLX100-3FGG676C, part E) BANK 4
- (in symbol FPGA_XC6SLX100-3FGG676C, part F) BANK 5

### Library data of the parts
C154-C188 C?#1-C?#8 = CAP - 0402: Precision: 10%; Current: *; CreatedBy: Jonathan Bouchard; Power: *
U8 = FPGA_XC6SLX100-3FGG676C: as U8 on sheet APP_1_JTAG_m; Current: *; Power: *; Mfg: Xilinx; Mfg Part Number: XC6SLX100-3FGG676C; HelpURL: https://www.xilinx.com/support/documentation/data_sheets/ds162.pdf; CreatedBy: Jonathan Bouchard; Temperature: 0°C ~ 85°C (TJ); Value: *; Precision: *; Package: BGA-676; Supplier 1: Digikey; Supplier Part Number 1: 122-1760-ND

## Nets that join several sheets
1V2: APP_1_PowerAnalog (5 pins), APP_1_FPGA_2 (30 pins)
1V5: APP_1_FPGA_m (10 pins), APP_1_PowerAnalog (5 pins), APP_1_FPGA_2 (33 pins)
1V8: APP_1_ADC_m (12 pins), APP_1_Power_m (5 pins), APP_1_DAC_m (7 pins)
3V3: APP_1_FPGA_m (17 pins), APP_1_PLL_m (25 pins), APP_1_Connectors_m (J6.10 J6.12), APP_1_DriveMoteur_m (7 pins), APP_1_Power_m (27 pins), APP_1_Ethernet_m (5 pins), APP_1_Flash_m (21 pins), APP_1_PowerAnalog (8 pins), APP_1_FPGA_2 (36 pins)
5V5: APP_1_Power_m (13 pins), APP_1_PowerAnalog (C135.2 U11.13 U11.15 U11.16)
24V: APP_1_Connectors_m (D4.4 F1.2 R1.2), APP_1_DriveMoteur_m (6 pins), APP_1_Power_m (C4.2 U1.2 U1.3), APP_1_PowerAnalog (C143.2 R109.2 U18.26)
+5: APP_1_ADC_m (6 pins), APP_1_DAC_m (C130.2 C131.2 U15.8)
-5V: APP_1_ADC_m (U17.15 U17.16 U17.21 U17.22), APP_1_PowerAnalog (5 pins)
A3V3: APP_1_PLL_m (L3.2 U10.1 U10.47), APP_1_ADC_m (9 pins), APP_1_Power_m (5 pins), APP_1_DAC_m (8 pins)
DDR3_0V75: APP_1_DDR3_m (44 pins), APP_1_Power_m (5 pins)
DDR3_1V5: APP_1_DDR3_m (28 pins), APP_1_Power_m (5 pins)
GND: APP_1_FPGA_m (79 pins), APP_1_DDR3_m (57 pins), APP_1_PLL_m (26 pins), APP_1_ADC_m (32 pins), APP_1_Connectors_m (37 pins), APP_1_DriveMoteur_m (19 pins), APP_1_Power_m (62 pins), APP_1_Ethernet_m (16 pins), APP_1_Flash_m (6 pins), APP_1_DAC_m (28 pins), APP_1_JTAG_m (6 pins), APP_1_PowerAnalog (58 pins), APP_1_FPGA_2 (35 pins)
USB_3V3: APP_1_Connectors_m (ISO1.12 ISO1.14 ISO1.16 R4.2), APP_1_JTAG_m (M1.2 M1.8 M1.15 R106.2)
ADC_IN_1: APP_1_ADC_m (R101.2 R103.2), APP_1_Connectors_m (D1.1 J1.1)
ADC_IN_2: APP_1_ADC_m (R93.2 R95.2), APP_1_Connectors_m (D6.1 J4.1)
DAC_OUT_1: APP_1_Connectors_m (D2.1 J2.1), APP_1_DAC_m (R77.1)
DAC_OUT_2: APP_1_Connectors_m (D7.1 J5.1), APP_1_DAC_m (R84.1)
DDR3_BA0: APP_1_FPGA_m (U8.P3), APP_1_DDR3_m (R52.1 U9.M2)
DDR3_BA1: APP_1_FPGA_m (U8.P1), APP_1_DDR3_m (R53.1 U9.N8)
DDR3_BA2: APP_1_FPGA_m (U8.N5), APP_1_DDR3_m (R54.1 U9.M3)
DDR3_CAS_N: APP_1_FPGA_m (U8.P8), APP_1_DDR3_m (R58.1 U9.K3)
DDR3_CK_N: APP_1_FPGA_m (U8.R3), APP_1_DDR3_m (R56.1 U9.K7)
DDR3_CK_P: APP_1_FPGA_m (U8.R4), APP_1_DDR3_m (R55.2 U9.J7)
DDR3_ODT: APP_1_FPGA_m (U8.P6), APP_1_DDR3_m (R60.1 U9.K1)
DDR3_RAS_N: APP_1_FPGA_m (U8.N8), APP_1_DDR3_m (R57.1 U9.J3)
DDR3_UDM: APP_1_FPGA_m (U8.V4), APP_1_DDR3_m (U9.D3)
DDR3_UDQS_N: APP_1_FPGA_m (U8.AC1), APP_1_DDR3_m (U9.B7)
DDR3_UDQS_P: APP_1_FPGA_m (U8.AC2), APP_1_DDR3_m (U9.C7)
DDR3_WE_N: APP_1_FPGA_m (U8.P5), APP_1_DDR3_m (R59.1 U9.L3)
DRV_AOUT_1: APP_1_Connectors_m (D12.1 J8.1), APP_1_DriveMoteur_m (U13.4)
DRV_AOUT_2: APP_1_Connectors_m (D11.1 J8.2), APP_1_DriveMoteur_m (U13.25)
DRV_BOUT_1: APP_1_Connectors_m (D10.1 J8.3), APP_1_DriveMoteur_m (U13.11)
DRV_BOUT_2: APP_1_Connectors_m (D9.1 J8.4), APP_1_DriveMoteur_m (U13.18)
ETH_INTRP: APP_1_Ethernet_m (R20.1 U7.21), APP_1_FPGA_2 (U8.W22)
ETH_MDIO: APP_1_Ethernet_m (R19.1 U7.11), APP_1_FPGA_2 (U8.V26)
ETH_RD_N: APP_1_Connectors_m (R2.1 T1.8), APP_1_Ethernet_m (U7.4)
ETH_RD_P: APP_1_Connectors_m (R2.2 T1.6), APP_1_Ethernet_m (U7.5)
ETH_RXC: APP_1_Ethernet_m (R28.2), APP_1_FPGA_2 (U8.AA25)
ETH_RXD0: APP_1_Ethernet_m (R23.2), APP_1_FPGA_2 (U8.Y24)
ETH_RXD1: APP_1_Ethernet_m (R24.2), APP_1_FPGA_2 (U8.Y26)
ETH_RXD2: APP_1_Ethernet_m (R25.2), APP_1_FPGA_2 (U8.W24)
ETH_RXD3: APP_1_Ethernet_m (R26.2), APP_1_FPGA_2 (U8.W25)
ETH_RXDV: APP_1_Ethernet_m (R21.2), APP_1_FPGA_2 (U8.AA26)
ETH_RXER: APP_1_Ethernet_m (R22.2), APP_1_FPGA_2 (U8.AA24)
ETH_TD_N: APP_1_Connectors_m (T1.3), APP_1_Ethernet_m (U7.6)
ETH_TD_P: APP_1_Connectors_m (T1.1), APP_1_Ethernet_m (U7.7)
ETH_TXC: APP_1_Ethernet_m (R29.2), APP_1_FPGA_2 (U8.AB26)
ETH_TXD0: APP_1_Ethernet_m (U7.24), APP_1_FPGA_2 (U8.AC25)
ETH_TXD1: APP_1_Ethernet_m (U7.25), APP_1_FPGA_2 (U8.AD24)
ETH_TXD2: APP_1_Ethernet_m (U7.26), APP_1_FPGA_2 (U8.AF25)
ETH_TXD3: APP_1_Ethernet_m (U7.27), APP_1_FPGA_2 (U8.AE24)
ETH_TXEN: APP_1_Ethernet_m (U7.23), APP_1_FPGA_2 (U8.AD26)
ETH_TXER: APP_1_Ethernet_m (U7.31), APP_1_FPGA_2 (U8.AC26)
USB_DD_P: APP_1_Connectors_m (ISO1.10), APP_1_JTAG_m (M1.17)